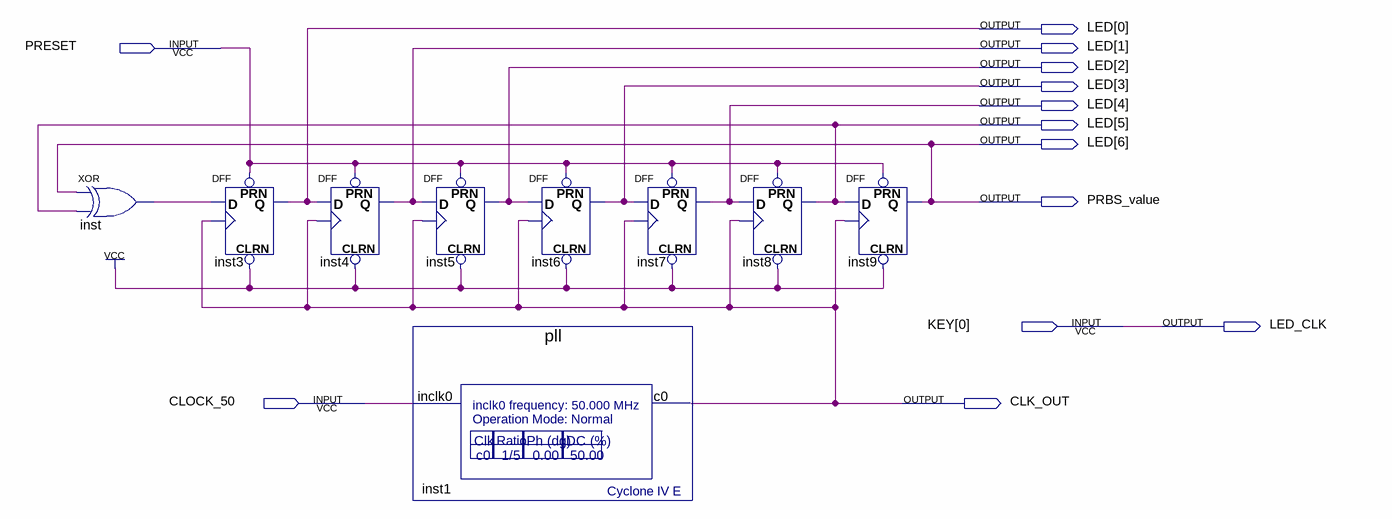
[diagram p0: schematic sheet]
// Quartus schematic BERT.bdf as structural Verilog: 9 symbols, 13 pins
module BERT (
  input  PRESET,
  input  [0:0] KEY,
  input  CLOCK_50,
  output [6:0] LED,
  output PRBS_value,
  output LED_CLK,
  output CLK_OUT
);

  wire inst_out;

  xor inst (inst_out, LED[6], LED[5]);
  DFF inst3 (.CLRN(1'b1), .CLK(CLK_OUT), .D(inst_out), .PRN(PRESET), .Q(LED[0]));
  DFF inst4 (.CLRN(1'b1), .CLK(CLK_OUT), .D(LED[0]), .PRN(PRESET), .Q(LED[1]));
  DFF inst5 (.CLRN(1'b1), .CLK(CLK_OUT), .D(LED[1]), .PRN(PRESET), .Q(LED[2]));
  pll inst1 (.inclk0(CLOCK_50), .c0(CLK_OUT));
  DFF inst6 (.CLRN(1'b1), .CLK(CLK_OUT), .D(LED[2]), .PRN(PRESET), .Q(LED[3]));
  DFF inst7 (.CLRN(1'b1), .CLK(CLK_OUT), .D(LED[3]), .PRN(PRESET), .Q(LED[4]));
  DFF inst8 (.CLRN(1'b1), .CLK(CLK_OUT), .D(LED[4]), .PRN(PRESET), .Q(LED[5]));
  DFF inst9 (.CLRN(1'b1), .CLK(CLK_OUT), .D(LED[5]), .PRN(PRESET), .Q(LED[6]));

  assign LED_CLK = KEY[0];
  assign PRBS_value = LED[6];
endmodule
